# Altium project 1_SPDIF_BRD_V1.PrjPCB
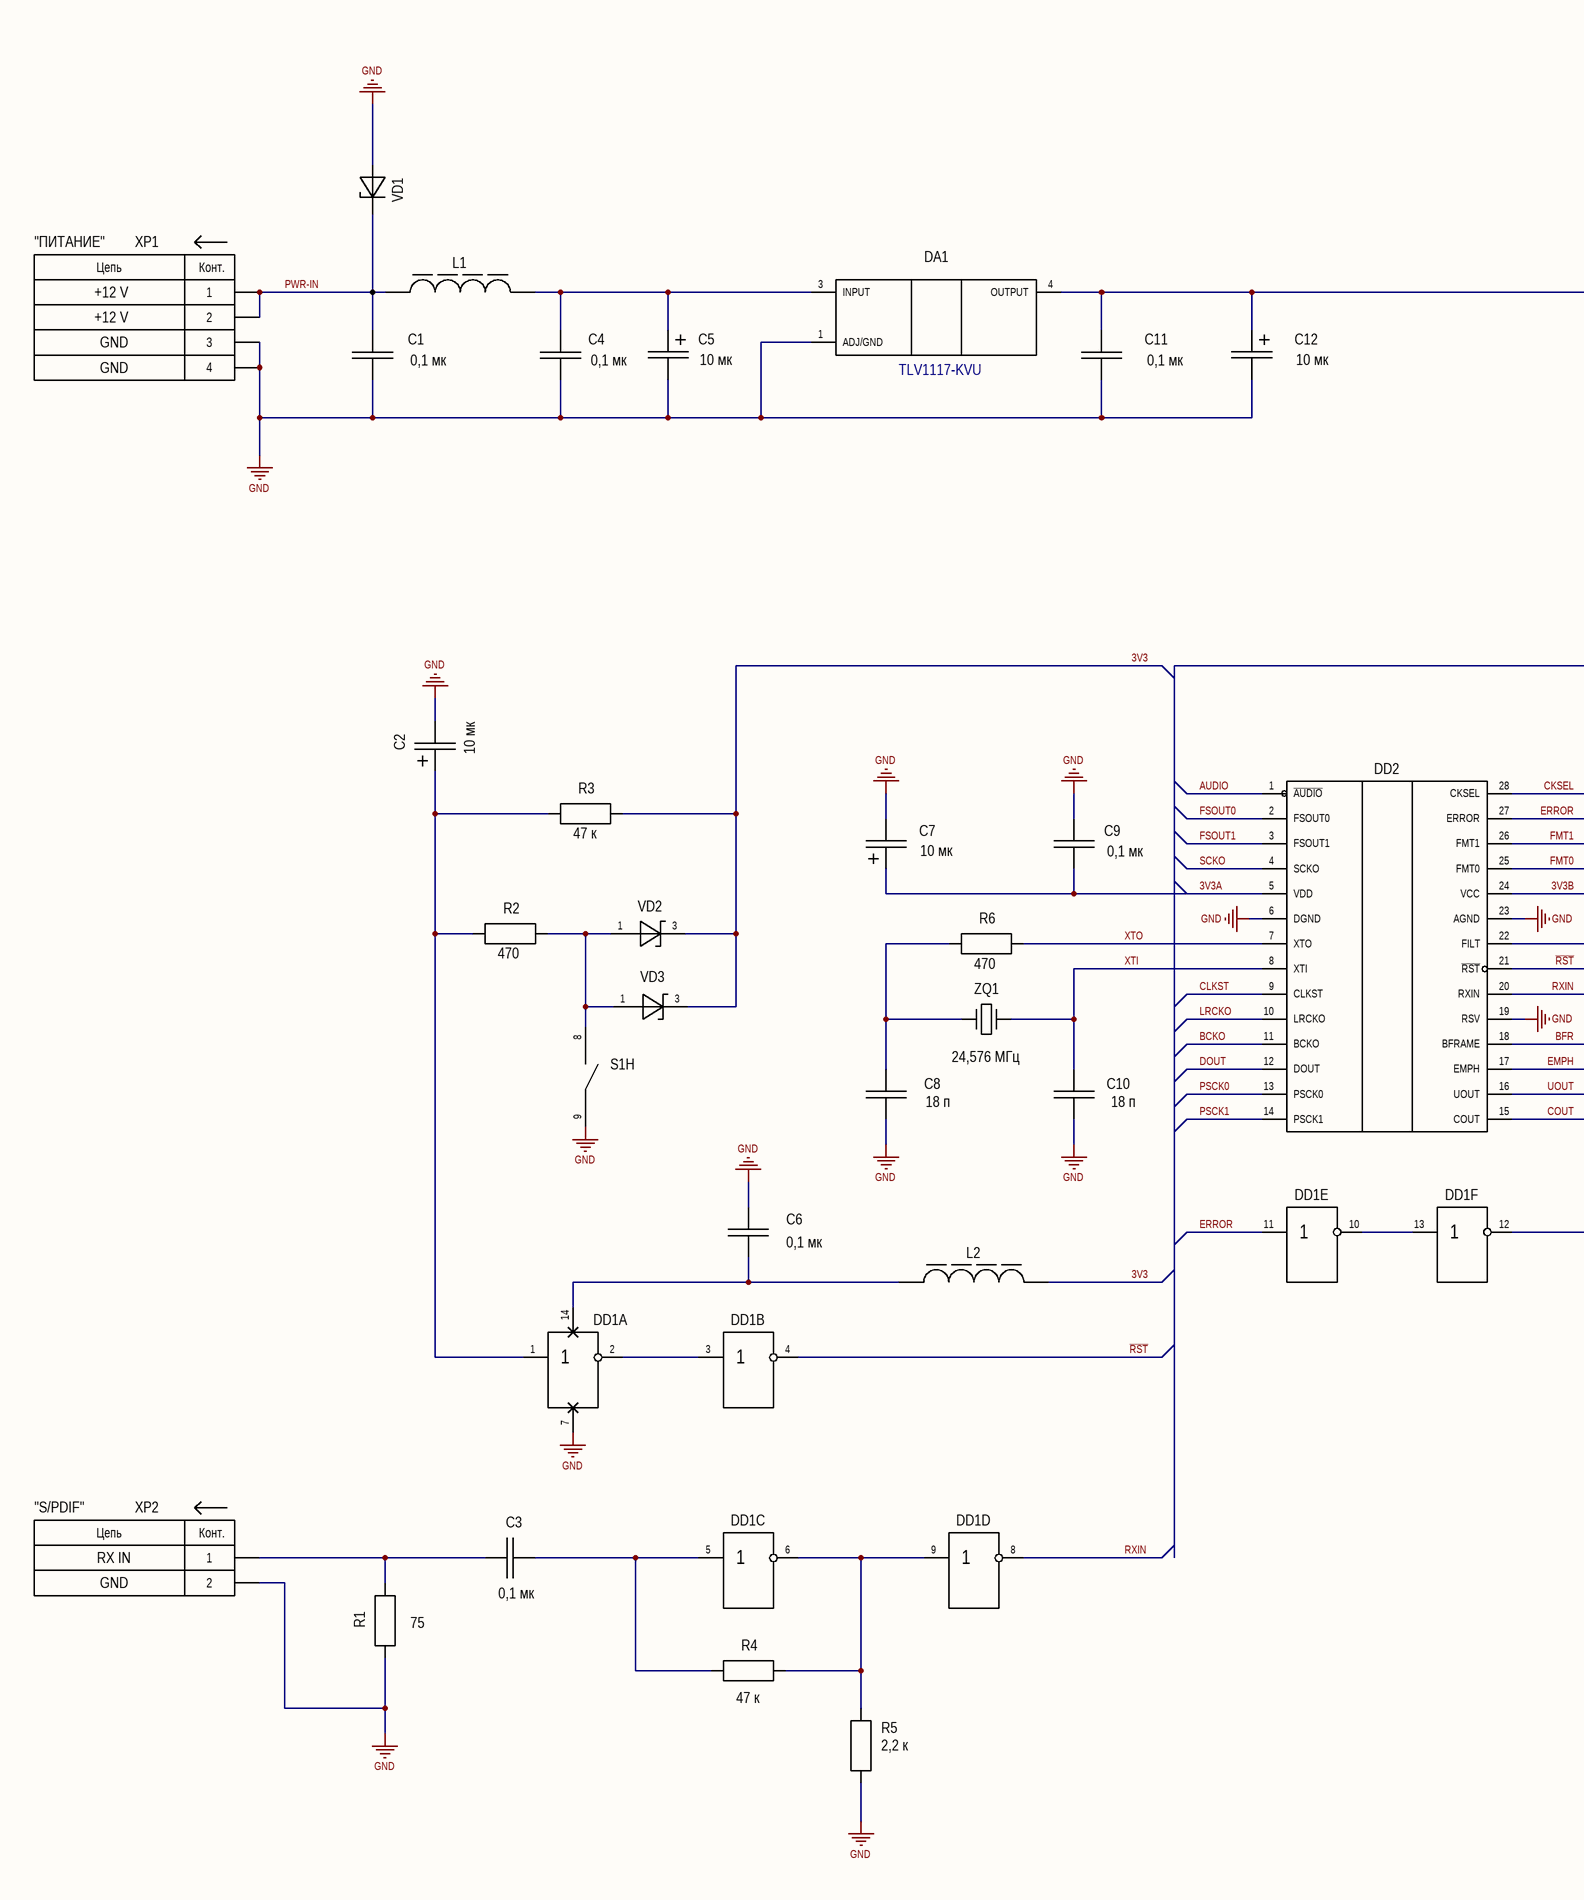
[diagram p0: 1_SPDIF_SCH_V1.SchDoc, left]
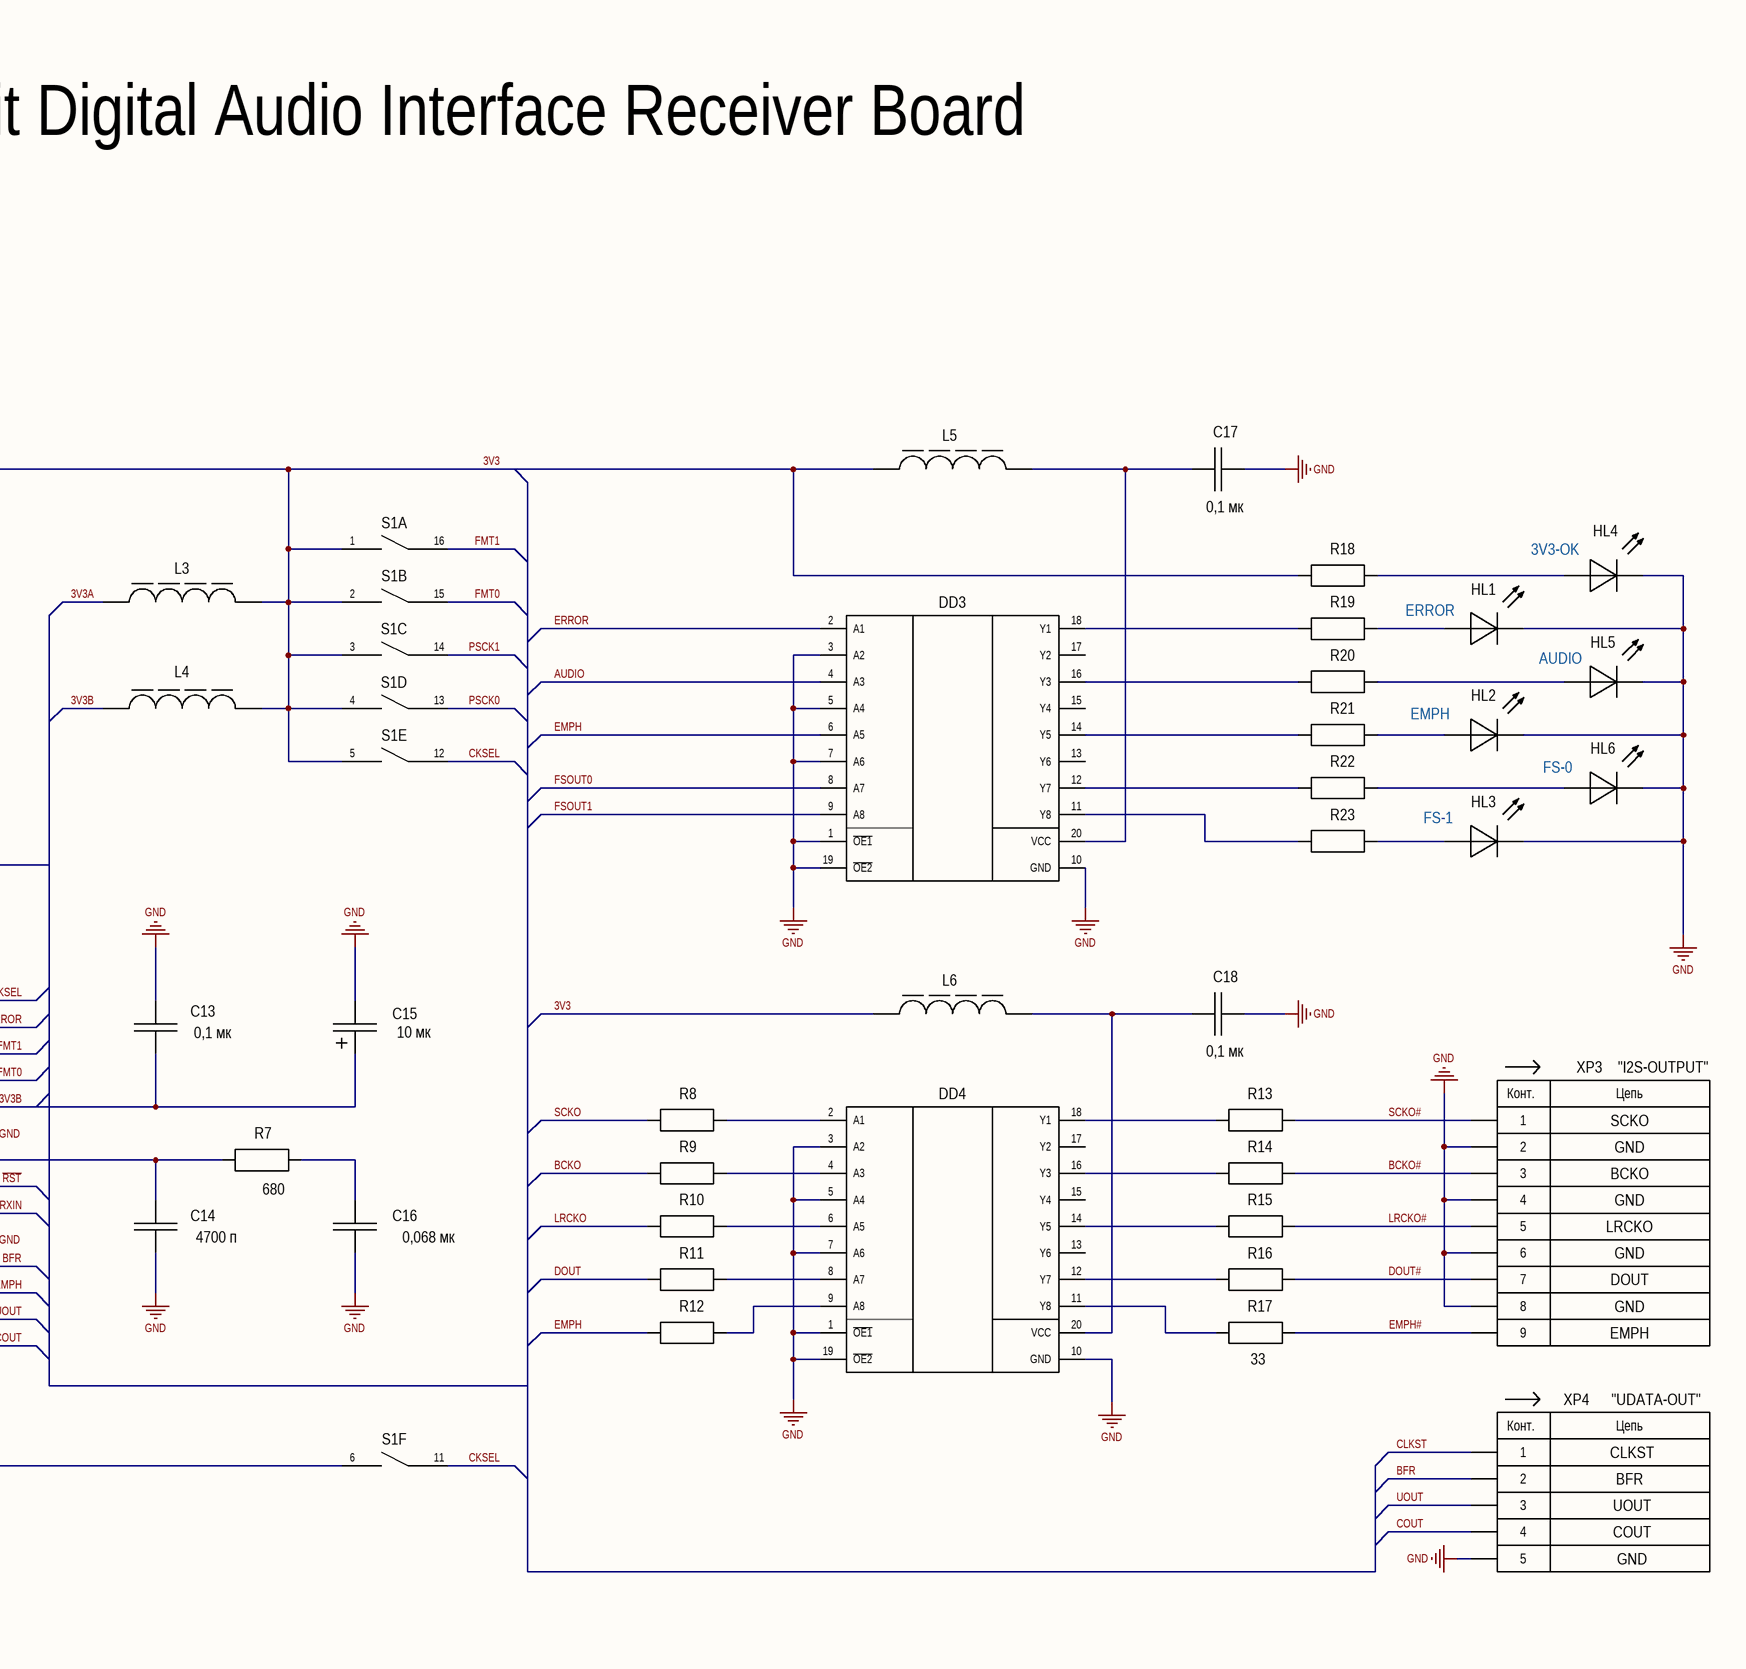
[diagram p1: 1_SPDIF_SCH_V1.SchDoc, right]
1 sheet, 67 parts. Net scope: global (net labels, ports and power ports of the same name join across sheets).
Board file: 1_SPDIF_PCB_V1x4.PcbDoc

## Sheet 1_SPDIF_SCH_V1.SchDoc
size A1; PageSetup: Record=PageOptions|CenterHorizontal=True|CenterVertical=True|PrintScale=1.00|XCorrection=1.00|YCorrection=1.00|PrintKind=1|BorderSize=5000000|LeftOffset=0|BottomOffset=0|Orientation=2|PaperLength=1000|PaperWidth=1000|Scale=100|PaperSource=15|PrintQuality=1200|MediaType=1|DitherType=10|PaperKind=A3|PrintScaleMode=1; Weight: -; ScaleFactor: -; NormInspection: Светличнова

### Parts
C1  Capacitance: 0,1 мк  [GRM21B R1]  (hidden comment: Конденсатор)
C2  Capacitance: 10 мк  [К53-68-C]  (hidden comment: Конд. полярный)
C3  Capacitance: 0,1 мк  [GRM21B R1]  (hidden comment: Конденсатор)
C4  Capacitance: 0,1 мк  [GRM21B R1]  (hidden comment: Конденсатор)
C5  Capacitance: 10 мк  [К53-68-C]  (hidden comment: Конд. полярный)
C6  Capacitance: 0,1 мк  [GRM21B R1]  (hidden comment: Конденсатор)
C7  Capacitance: 10 мк  [К53-68-C]  (hidden comment: Конд. полярный)
C8  Capacitance: 18 п  [GRM188 R1]  (hidden comment: Конденсатор)
C9  Capacitance: 0,1 мк  [GRM21B R1]  (hidden comment: Конденсатор)
C10  Capacitance: 18 п  [GRM188 R1]  (hidden comment: Конденсатор)
C11  Capacitance: 0,1 мк  [GRM21B R1]  (hidden comment: Конденсатор)
C12  Capacitance: 10 мк  [К53-68-C]  (hidden comment: Конд. полярный)
C13  Capacitance: 0,1 мк  [GRM21B R1]  (hidden comment: Конденсатор)
C14  Capacitance: 4700 п  [GRM31C R1]  (hidden comment: Конденсатор)
C15  Capacitance: 10 мк  [К53-68-C]  (hidden comment: Конд. полярный)
C16  Capacitance: 0,068 мк  [K10-79 3.2x1.6x1.6 N]  (hidden comment: Конденсатор)
C17  Capacitance: 0,1 мк  [GRM21B R1]  (hidden comment: Конденсатор)
C18  Capacitance: 0,1 мк  [GRM21B R1]  (hidden comment: Конденсатор)
DA1  TLV1117-KVU  [TO-252-TI-R1]
DD1  74XX04  [TSSOP-14-TI-R1]  (value not drawn)  (parts A,B,C,D,E,F of 6)
DD2  DIR9001PW  [PW28_N]  (value not drawn)
DD3  74XX541  [SOIC-20W IPC N (NXP)]  (value not drawn)
DD4  74XX541  [SOIC-20W IPC N (NXP)]  (value not drawn)
HL1  Светодиод  [LED KP-3216-R]  (value not drawn)
HL2  Светодиод  [LED KPT-3216-R]  (value not drawn)
HL3  Светодиод  [LED KPT-3216-R]  (value not drawn)
HL4  Светодиод  [LED KP-3216-R]  (value not drawn)
HL5  Светодиод  [LED KPT-3216-R]  (value not drawn)
HL6  Светодиод  [LED KPT-3216-R]  (value not drawn)
L1  Дроссель BLM  [INDC1608X10N]  (value not drawn)
L2  Дроссель BLM  [INDC1608X10N]  (value not drawn)
L3  Дроссель BLM  [INDC1608X10N]  (value not drawn)
L4  Дроссель BLM  [INDC1608X10N]  (value not drawn)
L5  Дроссель BLM  [INDC1608X10N]  (value not drawn)
L6  Дроссель BLM  [INDC1608X10N]  (value not drawn)
R1  Resistance: 75  [IEC 2013N]  (hidden comment: Резистор)
R2  Resistance: 470  [IEC 2013N]  (hidden comment: Резистор)
R3  Resistance: 47 к  [IEC 2013N]  (hidden comment: Резистор)
R4  Resistance: 47 к  [IEC 2013N]  (hidden comment: Резистор)
R5  Resistance: 2,2 к  [IEC 2013N]  (hidden comment: Резистор)
R6  Resistance: 470  [IEC 2013N]  (hidden comment: Резистор)
R7  Resistance: 680  [IEC 2013N]  (hidden comment: Резистор)
R8  Резистор  [IEC 2013N]  (value not drawn)
R9  Резистор  [IEC 2013N]  (value not drawn)
R10  Резистор  [IEC 2013N]  (value not drawn)
R11  Резистор  [IEC 2013N]  (value not drawn)
R12  Резистор  [IEC 2013N]  (value not drawn)
R13  Резистор  [IEC 2013N]  (value not drawn)
R14  Резистор  [IEC 2013N]  (value not drawn)
R15  Резистор  [IEC 2013N]  (value not drawn)
R16  Резистор  [IEC 2013N]  (value not drawn)
R17  Resistance: 33  [IEC 2013N]  (hidden comment: Резистор)
R18  Резистор  [IEC 2013N]  (value not drawn)
R19  Резистор  [IEC 2013N]  (value not drawn)
R20  Резистор  [IEC 2013N]  (value not drawn)
R21  Резистор  [IEC 2013N]  (value not drawn)
R22  Резистор  [IEC 2013N]  (value not drawn)
R23  Резистор  [IEC 2013N]  (value not drawn)
S1  NHDS08  [ПЕРЕКЛ. NHDS08]  (value not drawn)  (parts A,B,C,D,E,F,H of 8)
VD1  Стабилитрон  [SMBJ-LF-R1]  (value not drawn)
VD2  BAT54  [BAT54-VISHAY-R]  (value not drawn)
VD3  BAT54  [BAT54-VISHAY-R]  (value not drawn)
XP1  Назначение: "ПИТАНИЕ"  [СНП346-4ВП21-1]  (hidden comment: X4 Connector XP)
XP2  Назначение: "S/PDIF"  [СНП346-2ВП21-1]  (hidden comment: X2 Connector XP)
XP3  Назначение: "I2S-OUTPUT"  [СНП346-9ВП21-1]  (hidden comment: X9 Connector XP)
XP4  Назначение: "UDATA-OUT"  [СНП346-5ВП21-1]  (hidden comment: X5 Connector XP)
ZQ1  Частота: 24,576 МГц  [NX5032GA NDK]  (hidden comment: Кварц 2к)

### Nets
GND: C1.1 C2.2 C4.1 C5.2 C6.2 C7.2 C8.1 C9.2 C10.1 C11.1 C12.2 C13.2 C14.1 C15.2 C16.1 C17.2 C18.2 DA1.1(ADJ/GND) DD1.7(GND) DD2.6(DGND) DD2.19(RSV) DD2.23(AGND) DD3.1(~{OE1}) DD3.3(A2) DD3.5(A4) DD3.7(A6) DD3.10(GND) DD3.19(~{OE2}) DD4.1(~{OE1}) DD4.3(A2) DD4.5(A4) DD4.7(A6) DD4.10(GND) DD4.19(~{OE2}) HL1.2(C) HL2.2(C) HL3.2(C) HL4.2(C) HL5.2(C) HL6.2(C) R1.1 R5.1 S1.9 VD1.2(A) XP1.3 XP1.4 XP2.2 XP3.2 XP3.4 XP3.6 XP3.8 XP4.5
3V3: C11.2 C12.1 DA1.4(OUTPUT) L2.2 L3.2 L4.2 L5.1 L6.1 R3.2 R18.1 S1.1 S1.2 S1.3 S1.4 S1.5 VD2.3 VD3.3
3V3A: C7.1 C9.1 DD2.5(VDD) L3.1
3V3B: C13.1 C15.1 DD2.24(VCC) L4.1
AUDIO: DD2.1(~{AUDIO}) DD3.4(A3)
BCKO: DD2.11(BCKO) R9.1
BCKO#: R14.2 XP3.3
BFR: DD2.18(BFRAME) XP4.2
CKSEL: DD2.28(CKSEL) S1.11 S1.12
CLKST: DD2.9(CLKST) XP4.1
COUT: DD2.15(COUT) XP4.4
DOUT: DD2.12(DOUT) R11.1
DOUT#: R16.2 XP3.7
EMPH: DD2.17(EMPH) DD3.6(A5) R12.1
EMPH#: R17.2 XP3.9
ERROR: DD1.11(5A) DD2.27(ERROR) DD3.2(A1)
FMT0: DD2.25(FMT0) S1.15
FMT1: DD2.26(FMT1) S1.16
FSOUT0: DD2.2(FSOUT0) DD3.8(A7)
FSOUT1: DD2.3(FSOUT1) DD3.9(A8)
LRCKO: DD2.10(LRCKO) R10.1
LRCKO#: R15.2 XP3.5
PSCK0: DD2.13(PSCK0) S1.13
PSCK1: DD2.14(PSCK1) S1.14
PWR-IN: C1.2 L1.1 VD1.1(C) XP1.1 XP1.2
~{RST}: DD1.4(2Y) DD2.21(~{RST})
RXIN: DD1.8(4Y) DD2.20(RXIN)
SCKO: DD2.4(SCKO) R8.1
SCKO#: R13.2 XP3.1
UOUT: DD2.16(UOUT) XP4.3
XTI: C10.2 DD2.8(XTI) ZQ1.2
XTO: DD2.7(XTO) R6.2
NetC2_1: C2.1 DD1.1(1A) R2.1 R3.1
NetC3_1: C3.1 R1.2 XP2.1
NetC3_2: C3.2 DD1.5(3A) R4.1
NetC4_2: C4.2 C5.1 DA1.3(INPUT) L1.2
NetC6_1: C6.1 DD1.14(VCC) L2.1
NetC8_2: C8.2 R6.1 ZQ1.1
NetC14_2: C14.2 DD2.22(FILT) R7.1
NetC16_2: C16.2 R7.2
NetC17_1: C17.1 DD3.20(VCC) L5.2
NetC18_1: C18.1 DD4.20(VCC) L6.2
NetDD1_2: DD1.2(1Y) DD1.3(2A)
NetDD1_6: DD1.6(3Y) DD1.9(4A) R4.2 R5.2
NetDD1_10: DD1.10(5Y) DD1.13(6A)
NetDD1_12: DD1.12(6Y) S1.6
NetDD3_11: DD3.11(Y8) R23.1
NetDD3_12: DD3.12(Y7) R22.1
NetDD3_14: DD3.14(Y5) R21.1
NetDD3_16: DD3.16(Y3) R20.1
NetDD3_18: DD3.18(Y1) R19.1
NetDD4_2: DD4.2(A1) R8.2
NetDD4_4: DD4.4(A3) R9.2
NetDD4_6: DD4.6(A5) R10.2
NetDD4_8: DD4.8(A7) R11.2
NetDD4_9: DD4.9(A8) R12.2
NetDD4_11: DD4.11(Y8) R17.1
NetDD4_12: DD4.12(Y7) R16.1
NetDD4_14: DD4.14(Y5) R15.1
NetDD4_16: DD4.16(Y3) R14.1
NetDD4_18: DD4.18(Y1) R13.1
NetHL1_1: HL1.1(A) R19.2
NetHL2_1: HL2.1(A) R21.2
NetHL3_1: HL3.1(A) R23.2
NetHL4_1: HL4.1(A) R18.2
NetHL5_1: HL5.1(A) R20.2
NetHL6_1: HL6.1(A) R22.2
NetR2_2: R2.2 S1.8 VD2.1 VD3.1

Not connected (* = marked no-connect by the designer): DD3 13(Y6) 15(Y4) 17(Y2); DD4 13(Y6) 15(Y4) 17(Y2)

### Notes on the sheet
- S/PDIF, 96-kHz, 24-Bit Digital Audio Interface Receiver Board
- +12 V
- GND
- (near HL4) 3V3-OK
- (near HL1) ERROR
- (near HL5) AUDIO
- (near HL2) EMPH
- (near HL6) FS-0
- (near HL3) FS-1
- SCKO
- BCKO
- LRCKO
- DOUT
- EMPH
- BFR
- CLKST
- UOUT
- COUT
- RX IN
- Перв. примен.
- Справ. №
- Подп. и дата
- Инв. № дубл.
- Взам. инв. №
- Разраб.
- Изм.
- Лист
- № докум.
- Подп.
- Дата
- Лит.
- Масса
- Масштаб
- Пров.
- Листов
- Инв. № подл.
- Н.контр.
- Утв.
- Копировал
- Формат А1
- (in symbol 7000006) Цепь; Конт.
- (in symbol 7000008) Цепь; Конт.
- (in symbol 7000009) Конт.; Цепь
- (in symbol 7000013) Конт.; Цепь

### Library data of the parts
C1 C3 C4 C6 C9 C11 C13 C17 C18 = 2000024: 0,1 мкФ ±10% X7R 50В 0805; Part Number: GRM21BR71H104K; TU_Manufacturer: ф. Murata, Япония; Value: 0.1u; Group1: Постоянный; CompSource: Покупное; Full Name: Конденсатор GRM21BR71H104K ф. Murata, Япония; BomSection: Прочие изделия; CompID: 2000024; CompClass: Конденсатор; Mount: Поверхностный; DateStamp: 06.11.2018 21:23:09; Tolerance: ±10%; MaxVoltage: 50 В; Dielectric: X7R; ComponentLink1Description: Описание серии; ComponentLink1URL: \\srv-4\AltiumBase$\Datasheets\Murata Chip Monolithic Ceramic Capacitors.pdf
C2 C5 C7 C12 C15 = 2000510: Танталовый, тип C; Part Number: К53-68 "C"-16В-10 мкФ±10%; TU_Manufacturer: АЖЯР.673546.007 ТУ; Value: 10u; CompClass: Конденсатор; Group1: Постоянный; Grade: ВП; Mass: 0,3; CompSource: Покупное; Full Name: Конденсатор К53-68 "C"-16В-10 мкФ±10% АЖЯР.673546.007 ТУ; Tolerance: ±10%; MaxVoltage: 16 B; BomSection: Прочие изделия; CompID: 2000510; Mount: Поверхностный; DateStamp: 28.08.2017 13:55:04; ComponentLink1Description: Описание; ComponentLink1URL: \\srv-4\AltiumBase$\Datasheets\Конденсатор К53-68 АЖЯР.673546.007 (Описание).pdf; ComponentLink2Description: Технические условия; ComponentLink2URL: \\srv-4\AltiumBase$\Datasheets\Конденсатор К53-68 АЖЯР.673546.007 ТУ.PDF
C8 C10 = 2000015: 18 пФ ±5% C0G 50В 0603; Part Number: GRM1885C1H180J; TU_Manufacturer: ф. Murata, Япония; Value: 18p; Group1: Постоянный; CompSource: Покупное; Full Name: Конденсатор GRM1885C1H180J ф. Murata, Япония; BomSection: Прочие изделия; CompID: 2000015; CompClass: Конденсатор; Mount: Поверхностный; DateStamp: 27.02.2017 11:11:35; Tolerance: ±5%; MaxVoltage: 50 В; Dielectric: C0G; ComponentLink1Description: Описание серии; ComponentLink1URL: \\srv-4\AltiumBase$\Datasheets\Murata Chip Monolithic Ceramic Capacitors.pdf
C14 = 2000029: 4700 пФ ±10% X7R 1кВ 1206; Part Number: GRM31BR73A472K; TU_Manufacturer: ф. Murata, Япония; Value: 4700p; Group1: Постоянный; CompSource: Покупное; Full Name: Конденсатор GRM31BR73A472K ф. Murata, Япония; MaxVoltage: 1000 В; BomSection: Прочие изделия; CompID: 2000029; CompClass: Конденсатор; Mount: Поверхностный; DateStamp: 27.02.2017 14:18:34; Tolerance: ±10%; Dielectric: X7R; ComponentLink1Description: Описание серии; ComponentLink1URL: \\srv-4\AltiumBase$\Datasheets\Murata Chip Monolithic Ceramic Capacitors.pdf
C16 = 2000346: Чип-конденсатор 3.2 x 1.6 x 1.6 мм; Part Number: К10-79-25В-0,068 мкФ±20%-Н30; TU_Manufacturer: АЖЯР.673511.004 ТУ; Value: 0.068u; Group1: Постоянный; Grade: ВП; Mass: 0,15; CompSource: Покупное; Full Name: Конденсатор К10-79-25В-0,068 мкФ±20%-Н30 АЖЯР.673511.004 ТУ; Tolerance: ±20%; MaxVoltage: 25 В; Dielectric: Н30; BomSection: Прочие изделия; CompID: 2000346; CompClass: Конденсатор; Mount: Поверхностный; DateStamp: 02.08.2017 14:55:35; ComponentLink1Description: Описание; ComponentLink1URL: \\srv-4\AltiumBase$\Datasheets\Конденсатор К10-79 АЖЯР.673511.004 (Описание).pdf
DA1 = 6000109: 3,3V Fixed Low-Dropout Voltage Regulator, TO-252; Part Number: TLV1117-33IKVURG3; TU_Manufacturer: ф. Texas Instruments, США; Voltage: 3,3 V; CompClass: Микросхема; Group1: Стабилизатор; Grade: Industrial; Mass: 1; CompSource: Покупное; Full Name: Микросхема TLV1117-33IKVURG3 ф. Texas Instruments, США; BomSection: Прочие изделия; Type: *; CompID: 6000109; Mount: Поверхностный; DateStamp: 03.11.2018 18:52:56; ComponentLink1Description: Datasheet; ComponentLink1URL: \\srv-4\AltiumBase$\Datasheets\Микросхема TLV1117 ф. Texas Instruments.pdf
DD1 = 6000108: Hex Inverters ( 6 x логическое "НЕ" ), TSSOP-14; Part Number: SN74LVC04APWR; TU_Manufacturer: ф. Texas Instruments, США; CompClass: Микросхема; Group1: Логические элементы; Grade: Industrial; Mass: 1; CompSource: Покупное; Full Name: Микросхема SN74LVC04APWR ф. Texas Instruments, США; BomSection: Прочие изделия; CompID: 6000108; Mount: Поверхностный; DateStamp: 02.11.2018 17:23:40; ComponentLink1Description: Лист данных; ComponentLink1URL: \\srv-4\AltiumBase$\Datasheets\Микросхемы SN54LVC04A, SN74LVC04A ф. Texas Instruments, США.pdf
DD2 = 6000002: Конвертер интерфейса, 96 кГц, TSSOP-28; Part Number: DIR9001PWR; TU_Manufacturer: ф. Texas Instruments, США; CompClass: Микросхема; Group1: Цифровая; Grade: Automotive; CompSource: Покупное; Full Name: Микросхема DIR9001PWR ф. Texas Instruments, США; BomSection: Прочие изделия; CompID: 6000002; Mount: Поверхностный; DateStamp: 10.08.2018 11:17:46; ComponentLink1URL: \\srv-4\AltiumBase$\Datasheets\Микросхема DIR9001 ф. Texas Instruments.pdf
DD3 DD4 = 6000101: Octal buffer/line driver with 5 V tolerant inputs/outputs, 3 state, SO-20; Part Number: 74LVC541AD; TU_Manufacturer: ф. NXP, Нидерланды; CompClass: Микросхема; Group1: Буфер; Grade: Industrial; CompSource: Покупное; Full Name: Микросхема 74LVC541AD ф. NXP, Нидерланды; BomSection: Прочие изделия; CompID: 6000101; Mount: Поверхностный; DateStamp: 29.10.2018 15:31:22; ComponentLink1Description: Лист данных; ComponentLink1URL: \\srv-4\AltiumBase$\Datasheets\Микросхема 74LVC541A ф. NXP, Нидерланды.pdf
HL1 HL4 = 8000005: Hyper Red (650 nm) smd chip led lamp, 3.2x1.6x1.1 mm; Part Number: KP-3216SURCK; TU_Manufacturer: ф. Kingbright, КНР; Group1: Видимого спектра - красный; Grade: Industrial; Mass: 1; CompSource: Покупное; Full Name: Светодиод KP-3216SURCK ф. Kingbright, КНР; BomSection: Прочие изделия; CompID: 8000005; CompClass: Светодиод; Mount: Поверхностный; DateStamp: 14.11.2018 15:22:17; ComponentLink1Description: Datasheet; ComponentLink1URL: \\srv-4\AltiumBase$\Datasheets\Светодиод KP-3216SURCK ф. Kingbright, КНР.pdf
HL2 HL3 HL5 HL6 = 8000007: Super Bright Yellow (588 nm) smd chip led lamp, 3.2x1.6x0.75 mm; Part Number: KPT-3216SYC; TU_Manufacturer: ф. Kingbright, КНР; Group1: Видимого спектра - желтый; Grade: Industrial; Mass: 1; CompSource: Покупное; Full Name: Светодиод KPT-3216SYC ф. Kingbright, КНР; BomSection: Прочие изделия; CompID: 8000007; CompClass: Светодиод; Mount: Поверхностный; DateStamp: 14.11.2018 15:18:38; ComponentLink1Description: Datasheet; ComponentLink1URL: \\srv-4\AltiumBase$\Datasheets\Светодиод KPT-3216SYC ф. Kingbright, КНР.pdf
L1-L6 = 3000424: Chip Ferrite Bead - 2000 mA, 220 Ohm (@100 MHz), SMD 0603; Part Number: BLM18EG221SN1; TU_Manufacturer: ф. Murata, Япония; Grade: Industrial; Mass: 1; CompSource: Покупное; Full Name: Дроссель BLM18EG221SN1 ф. Murata, Япония; Inductance: н; MaxCurrent: 2 A; DCR: 0.05; Value: n; BomSection: Прочие изделия; CompID: 3000424; CompClass: Дроссель; Mount: Поверхностный; DateStamp: 13.11.2018 18:40:44; ComponentLink1Description: Datasheet; ComponentLink1URL: \\srv-4\AltiumBase$\Datasheets\Дроссель BLM18EGxxxx ф. Murata, Япония.pdf
R1 = 1001255: Чип-резистор 1206; Part Number: Р1-12-0,25-75 Ом±5%-Т; TU_Manufacturer: АЛЯР.434110.005 ТУ; Value: 75; MaxPower: 0,25 Вт; Group1: Постоянный; Grade: ВП; Mass: 0,015; CompSource: Покупное; Full Name: Резистор Р1-12-0,25-75 Ом±5%-Т АЛЯР.434110.005 ТУ; Tolerance: ±5%; TCR: Т; BomSection: Прочие изделия; CompID: 1001255; CompClass: Резистор; Mount: Поверхностный; DateStamp: 15.05.2017 16:59:21; ComponentLink1Description: Описание; ComponentLink1URL: \\srv-4\AltiumBase$\Datasheets\Резистор Р1-12 АЛЯР.434110.005 ТУ.pdf
R2 R6 = 1001274: Чип-резистор 1206; Part Number: Р1-12-0,25-470 Ом±5%-Т; TU_Manufacturer: АЛЯР.434110.005 ТУ; Value: 470; MaxPower: 0,25 Вт; Group1: Постоянный; Grade: ВП; Mass: 0,015; CompSource: Покупное; Full Name: Резистор Р1-12-0,25-470 Ом±5%-Т АЛЯР.434110.005 ТУ; Tolerance: ±5%; TCR: Т; BomSection: Прочие изделия; CompID: 1001274; CompClass: Резистор; Mount: Поверхностный; DateStamp: 15.05.2017 16:59:24; ComponentLink1Description: Описание; ComponentLink1URL: \\srv-4\AltiumBase$\Datasheets\Резистор Р1-12 АЛЯР.434110.005 ТУ.pdf
R3 R4 = 1001322: Чип-резистор 1206; Part Number: Р1-12-0,25-47 кОм±5%-Т; TU_Manufacturer: АЛЯР.434110.005 ТУ; Value: 47k; MaxPower: 0,25 Вт; Group1: Постоянный; Grade: ВП; Mass: 0,015; CompSource: Покупное; Full Name: Резистор Р1-12-0,25-47 кОм±5%-Т АЛЯР.434110.005 ТУ; Tolerance: ±5%; TCR: Т; BomSection: Прочие изделия; CompID: 1001322; CompClass: Резистор; Mount: Поверхностный; DateStamp: 15.05.2017 16:59:34; ComponentLink1Description: Описание; ComponentLink1URL: \\srv-4\AltiumBase$\Datasheets\Резистор Р1-12 АЛЯР.434110.005 ТУ.pdf
R5 = 1001290: Чип-резистор 1206; Part Number: Р1-12-0,25-2,2 кОм±5%-Т; TU_Manufacturer: АЛЯР.434110.005 ТУ; Value: 2.2k; MaxPower: 0,25 Вт; Group1: Постоянный; Grade: ВП; Mass: 0,015; CompSource: Покупное; Full Name: Резистор Р1-12-0,25-2,2 кОм±5%-Т АЛЯР.434110.005 ТУ; Tolerance: ±5%; TCR: Т; BomSection: Прочие изделия; CompID: 1001290; CompClass: Резистор; Mount: Поверхностный; DateStamp: 15.05.2017 16:59:27; ComponentLink1Description: Описание; ComponentLink1URL: \\srv-4\AltiumBase$\Datasheets\Резистор Р1-12 АЛЯР.434110.005 ТУ.pdf
R7 = 1001278: Чип-резистор 1206; Part Number: Р1-12-0,25-680 Ом±5%-Т; TU_Manufacturer: АЛЯР.434110.005 ТУ; Value: 680; MaxPower: 0,25 Вт; Group1: Постоянный; Grade: ВП; Mass: 0,015; CompSource: Покупное; Full Name: Резистор Р1-12-0,25-680 Ом±5%-Т АЛЯР.434110.005 ТУ; Tolerance: ±5%; TCR: Т; BomSection: Прочие изделия; CompID: 1001278; CompClass: Резистор; Mount: Поверхностный; DateStamp: 15.05.2017 16:59:25; ComponentLink1Description: Описание; ComponentLink1URL: \\srv-4\AltiumBase$\Datasheets\Резистор Р1-12 АЛЯР.434110.005 ТУ.pdf
R8-R17 = 1001246: Чип-резистор 1206; Part Number: Р1-12-0,25-33 Ом±5%-Т; TU_Manufacturer: АЛЯР.434110.005 ТУ; Value: 33; MaxPower: 0,25 Вт; Group1: Постоянный; Grade: ВП; Mass: 0,015; CompSource: Покупное; Full Name: Резистор Р1-12-0,25-33 Ом±5%-Т АЛЯР.434110.005 ТУ; Tolerance: ±5%; TCR: Т; BomSection: Прочие изделия; CompID: 1001246; CompClass: Резистор; Mount: Поверхностный; DateStamp: 15.05.2017 16:59:19; ComponentLink1Description: Описание; ComponentLink1URL: \\srv-4\AltiumBase$\Datasheets\Резистор Р1-12 АЛЯР.434110.005 ТУ.pdf
  R8-R16: Resistance: 33
R18-R23 = 1001270: Чип-резистор 1206; Part Number: Р1-12-0,25-330 Ом±5%-Т; TU_Manufacturer: АЛЯР.434110.005 ТУ; Value: 330; MaxPower: 0,25 Вт; Group1: Постоянный; Grade: ВП; Mass: 0,015; CompSource: Покупное; Full Name: Резистор Р1-12-0,25-330 Ом±5%-Т АЛЯР.434110.005 ТУ; Tolerance: ±5%; TCR: Т; BomSection: Прочие изделия; Resistance: 330; CompID: 1001270; CompClass: Резистор; Mount: Поверхностный; DateStamp: 15.05.2017 16:59:23; ComponentLink1Description: Описание; ComponentLink1URL: \\srv-4\AltiumBase$\Datasheets\Резистор Р1-12 АЛЯР.434110.005 ТУ.pdf
S1 = 7000001: Surface mount dip switch with tape seal option, 24VDC, 25mA; TU_Manufacturer: ф. Apem, США; Высота: 1.5 мм; Производитель: ф. Apem; Страна происхождения: Великобритания; CompClass: Переключатель; Grade: Industrial; Mass: 1; CompSource: Покупное; Full Name: Переключатель NHDS08 ф. Apem, США; BomSection: Прочие изделия; CompID: 7000001; Part Number: NHDS08; Mount: Поверхностный; DateStamp: 14.11.2018 16:37:12; ComponentLink1Description: Datasheet; ComponentLink1URL: \\srv-4\AltiumBase$\Datasheets\Микропереключатель NHDS-08 ф. APEM, США.pdf
VD1 = 4000045: TVS Diode, Uni-directional, 12V, DO-214AA (SMB J-Bend); Part Number: SMBJ12A; TU_Manufacturer: ф. Littelfuse, США; CompClass: Диод; Group1: Диод защитный; Grade: Military; Mass: 0.093; CompSource: Покупное; Full Name: Диод SMBJ12A ф. Littelfuse, США; BomSection: Прочие изделия; CompID: 4000045; Mount: Поверхностный; DateStamp: 20.11.2018 17:38:45; ComponentLink1Description: Описание серии; ComponentLink1URL: \\srv-4\AltiumBase$\Datasheets\Диоды защитные SMBJ ф. Littelfuse, США.pdf
VD2 VD3 = 4000031: Single Small Signal Schottky Diode, SOT-23-3; TU_Manufacturer: ф. Vishay, США; CompClass: Диод; Grade: Automotive; Mass: 0.0088; CompSource: Покупное; Full Name: Диод BAT54 ф. Vishay, США; BomSection: Прочие изделия; CompID: 4000031; Part Number: BAT54; Mount: Поверхностный; DateStamp: 15.11.2018 13:02:51; ComponentLink1Description: Описание серии; ComponentLink1URL: \\srv-4\AltiumBase$\Datasheets\Диоды BAT54 ф. Vishay, США.pdf
XP1 = 7000008: Вилка СНП346 однорядная, прямая, 4 контакта; Part Number: СНП346-4ВП21-1-В; TU_Manufacturer: РЮМК.430420.011 ТУ; CompClass: Соединитель; Grade: ВП; Mass: 0,24; CompSource: Покупное; Full Name: Соединитель СНП346-4ВП21-1-В РЮМК.430420.011 ТУ; BomSection: Прочие изделия; CompID: 7000008; Group1: Вилка; Mount: Штырьевой; DateStamp: 06.11.2018 13:50:24; ComponentLink1Description: Технические условия; ComponentLink1URL: \\srv-4\AltiumBase$\Datasheets\Соединители типа СНП346 РЮМК.430420.011ТУ.PDF
XP2 = 7000006: Вилка СНП346 однорядная, прямая, 2 контакта; Part Number: СНП346-2ВП21-1-В; TU_Manufacturer: РЮМК.430420.011 ТУ; CompClass: Соединитель; Grade: ВП; Mass: 0,12; CompSource: Покупное; Full Name: Соединитель СНП346-2ВП21-1-В РЮМК.430420.011 ТУ; BomSection: Прочие изделия; CompID: 7000006; Group1: Вилка; Mount: Штырьевой; DateStamp: 06.11.2018 13:48:31; ComponentLink1Description: Технические условия; ComponentLink1URL: \\srv-4\AltiumBase$\Datasheets\Соединители типа СНП346 РЮМК.430420.011ТУ.PDF
XP3 = 7000013: Вилка СНП346 однорядная, прямая, 9 контактов; Part Number: СНП346-9ВП21-1-В; TU_Manufacturer: РЮМК.430420.011 ТУ; CompClass: Соединитель; Grade: ВП; Mass: 0,54; CompSource: Покупное; Full Name: Соединитель СНП346-9ВП21-1-В РЮМК.430420.011 ТУ; BomSection: Прочие изделия; CompID: 7000013; Group1: Вилка; Mount: Штырьевой; DateStamp: 06.11.2018 13:54:59; ComponentLink1Description: Технические условия; ComponentLink1URL: \\srv-4\AltiumBase$\Datasheets\Соединители типа СНП346 РЮМК.430420.011ТУ.PDF
XP4 = 7000009: Вилка СНП346 однорядная, прямая, 5 контактов; Part Number: СНП346-5ВП21-1-В; TU_Manufacturer: РЮМК.430420.011 ТУ; CompClass: Соединитель; Grade: ВП; Mass: 0,3; CompSource: Покупное; Full Name: Соединитель СНП346-5ВП21-1-В РЮМК.430420.011 ТУ; BomSection: Прочие изделия; CompID: 7000009; Group1: Вилка; Mount: Штырьевой; DateStamp: 06.11.2018 13:52:08; ComponentLink1Description: Технические условия; ComponentLink1URL: \\srv-4\AltiumBase$\Datasheets\Соединители типа СНП346 РЮМК.430420.011ТУ.PDF
ZQ1 = 9000042: Резонатор кварцевый 24,576 МГц, SMD; Part Number: NX5032GA-24.576M-STD-CSK-4; TU_Manufacturer: ф. NDK, Япония; Grade: Commercial; Mass: 1; CompSource: Покупное; Full Name: Резонатор кварцевый NX5032GA-24.576M-STD-CSK-4 ф. NDK, Япония; BomSection: Прочие изделия; CompID: 9000042; CompClass: Резонатор кварцевый; Mount: Поверхностный; DateStamp: 08.11.2018 15:35:16; ComponentLink1Description: Datasheet; ComponentLink1URL: \\srv-4\AltiumBase$\Datasheets\Резонатор кварцевый NX5032GA ф. NDK, Япония (STD-CSK-3,4,7,8).pdf.pdf